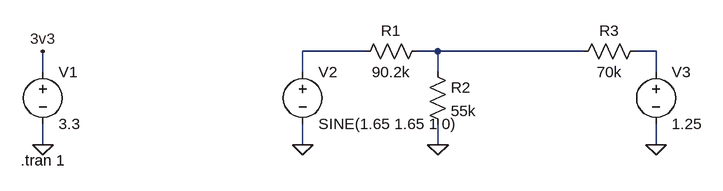
[diagram p0: schematic frontend_v2_hys_circuit.asc]
frontend_v2_hys_circuit.asc, the LTspice schematic file:
Version 4
SHEET 1 880 680
WIRE 160 128 64 128
WIRE 272 128 240 128
WIRE 496 128 272 128
WIRE 608 128 576 128
WIRE -336 160 -336 128
WIRE 64 160 64 128
WIRE 272 160 272 128
WIRE 608 160 608 128
WIRE -336 272 -336 240
WIRE 64 272 64 240
WIRE 272 272 272 240
WIRE 608 272 608 240
FLAG -336 128 3v3
FLAG -336 272 0
FLAG 64 272 0
FLAG 272 272 0
FLAG 608 272 0
SYMBOL voltage -336 144 R0
WINDOW 123 0 0 Left 2
WINDOW 39 0 0 Left 2
SYMATTR InstName V1
SYMATTR Value 3.3
SYMBOL voltage 64 144 R0
WINDOW 123 0 0 Left 2
WINDOW 39 0 0 Left 2
SYMATTR InstName V2
SYMATTR Value SINE(1.65 1.65 1 0)
SYMBOL voltage 608 144 R0
WINDOW 123 0 0 Left 2
WINDOW 39 0 0 Left 2
SYMATTR InstName V3
SYMATTR Value 1.25
SYMBOL res 256 112 R90
WINDOW 0 0 56 VBottom 2
WINDOW 3 32 56 VTop 2
SYMATTR InstName R1
SYMATTR Value 90.2k
SYMBOL res 256 144 R0
SYMATTR InstName R2
SYMATTR Value 55k
SYMBOL res 592 112 R90
WINDOW 0 0 56 VBottom 2
WINDOW 3 32 56 VTop 2
SYMATTR InstName R3
SYMATTR Value 70k
TEXT -370 296 Left 2 !.tran 1

The netlist it stands for:
* frontend_v2_hys_circuit.asc
V1 3v3 0 3.3
V2 N001 0 SINE(1.65 1.65 1 0)
V3 N003 0 1.25
R1 N002 N001 90.2k
R2 N002 0 55k
R3 N003 N002 70k
.tran 1
.backanno
.end